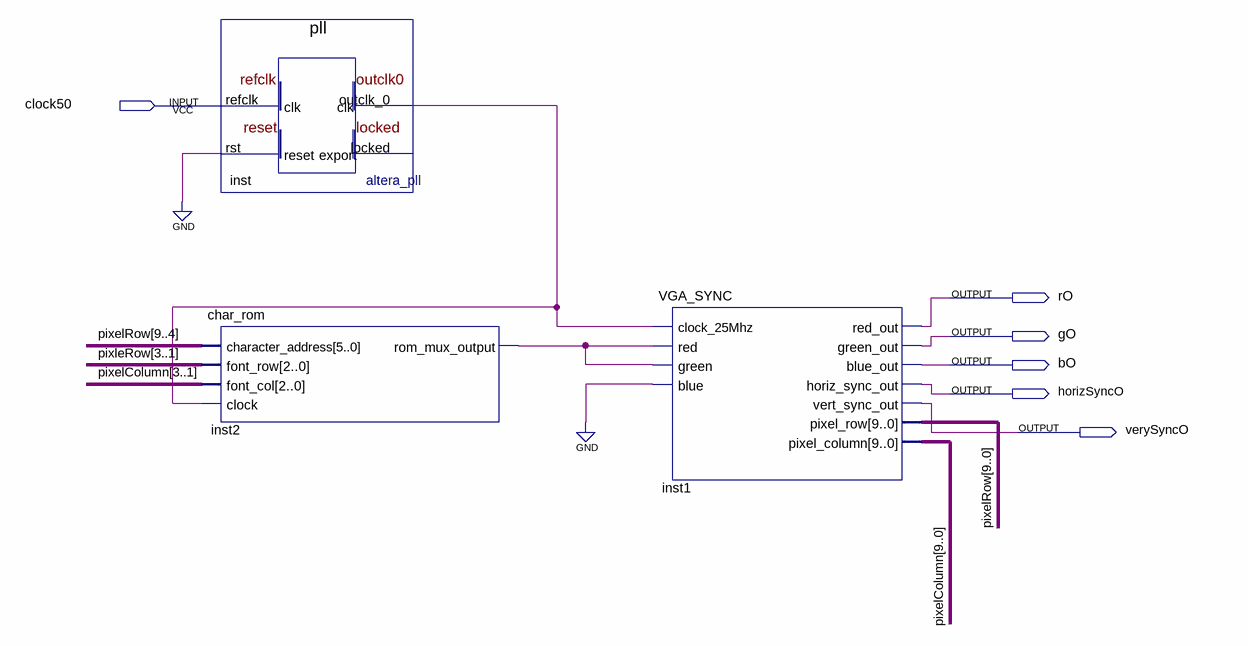
[diagram p0: schematic sheet]
// Quartus schematic text_display.bdf as structural Verilog: 3 symbols, 6 pins
module text_display (
  input  clock50,
  output rO,
  output gO,
  output bO,
  output horizSyncO,
  output verySyncO
);

  wire inst2_rom_mux_output, inst_outclk_0;
  wire [3:1] pixleRow;
  wire [9:0] pixelColumn, pixelRow;

  pll inst (.refclk(clock50), .rst(1'b0), .outclk_0(inst_outclk_0));  // open: locked
  char_rom inst2 (
    .character_address(pixelRow[9:4]), .font_row(pixleRow), .font_col(pixelColumn[3:1]),
    .clock(inst_outclk_0), .rom_mux_output(inst2_rom_mux_output));
  VGA_SYNC inst1 (
    .clock_25Mhz(inst_outclk_0), .red(inst2_rom_mux_output), .green(inst2_rom_mux_output), .blue(1'b0),
    .red_out(rO), .green_out(gO), .blue_out(bO), .horiz_sync_out(horizSyncO), .vert_sync_out(verySyncO),
    .pixel_row(pixelRow), .pixel_column(pixelColumn));
endmodule
